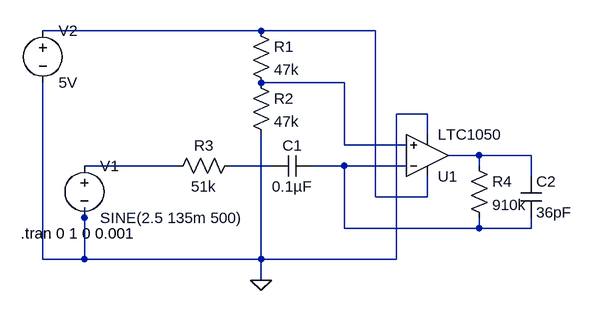
[diagram p0: schematic ACS712.asc]
ACS712.asc, the LTspice schematic file:
Version 4
SHEET 1 880 680
WIRE 48 -32 -288 -32
WIRE 224 -32 48 -32
WIRE 176 48 48 48
WIRE 304 96 256 96
WIRE 304 128 304 96
WIRE 176 144 176 48
WIRE 272 144 176 144
WIRE 384 160 336 160
WIRE 464 160 384 160
WIRE -80 176 -224 176
WIRE 64 176 0 176
WIRE 176 176 128 176
WIRE 272 176 176 176
WIRE 384 176 384 160
WIRE 464 192 464 160
WIRE 224 224 224 -32
WIRE 304 224 304 192
WIRE 304 224 224 224
WIRE -224 256 -224 240
WIRE 176 272 176 176
WIRE 384 272 384 256
WIRE 384 272 176 272
WIRE 464 272 464 256
WIRE 464 272 384 272
WIRE -288 320 -288 48
WIRE -224 320 -224 256
WIRE -224 320 -288 320
WIRE 48 320 48 128
WIRE 48 320 -224 320
WIRE 256 320 256 96
WIRE 256 320 48 320
WIRE 48 352 48 320
FLAG 48 352 0
SYMBOL Opamps\\LTC1050 304 224 M180
SYMATTR InstName U1
SYMBOL res 32 -48 R0
SYMATTR InstName R1
SYMATTR Value 47k
SYMBOL res 16 160 R90
WINDOW 0 0 56 VBottom 2
WINDOW 3 32 56 VTop 2
SYMATTR InstName R3
SYMATTR Value 51k
SYMBOL voltage -224 160 R0
WINDOW 123 0 0 Left 2
WINDOW 39 0 0 Left 2
SYMATTR InstName V1
SYMATTR Value SINE(2.5 135m 500)
SYMBOL voltage -288 -48 R0
WINDOW 123 0 0 Left 2
WINDOW 39 0 0 Left 2
SYMATTR InstName V2
SYMATTR Value 5V
SYMBOL res 368 160 R0
SYMATTR InstName R4
SYMATTR Value 910k
SYMBOL cap 448 192 R0
SYMATTR InstName C2
SYMATTR Value 36pF
SYMBOL cap 128 160 R90
WINDOW 0 0 32 VBottom 2
WINDOW 3 32 32 VTop 2
SYMATTR InstName C1
SYMATTR Value 0.1µF
SYMBOL res 32 32 R0
SYMATTR InstName R2
SYMATTR Value 47k
TEXT -322 280 Left 2 !.tran 0 1 0 0.001

The netlist it stands for:
* ACS712.asc
XU1 N002 N006 N001 0 N003 LTC1050  ; pins In+ In- V+ V- OUT
R1 N001 N002 47k
R3 N005 N004 51k
V1 N004 0 SINE(2.5 135m 500)
V2 N001 0 5V
R4 N003 N006 910k
C2 N003 N006 36pF
C1 N006 N005 0.1µF
R2 N002 0 47k
.tran 0 1 0 0.001
.lib LTC.lib
.backanno
.end